# Altium schematic sheet 07-FPGA.SchDoc
size Tabloid; Customer: 01910
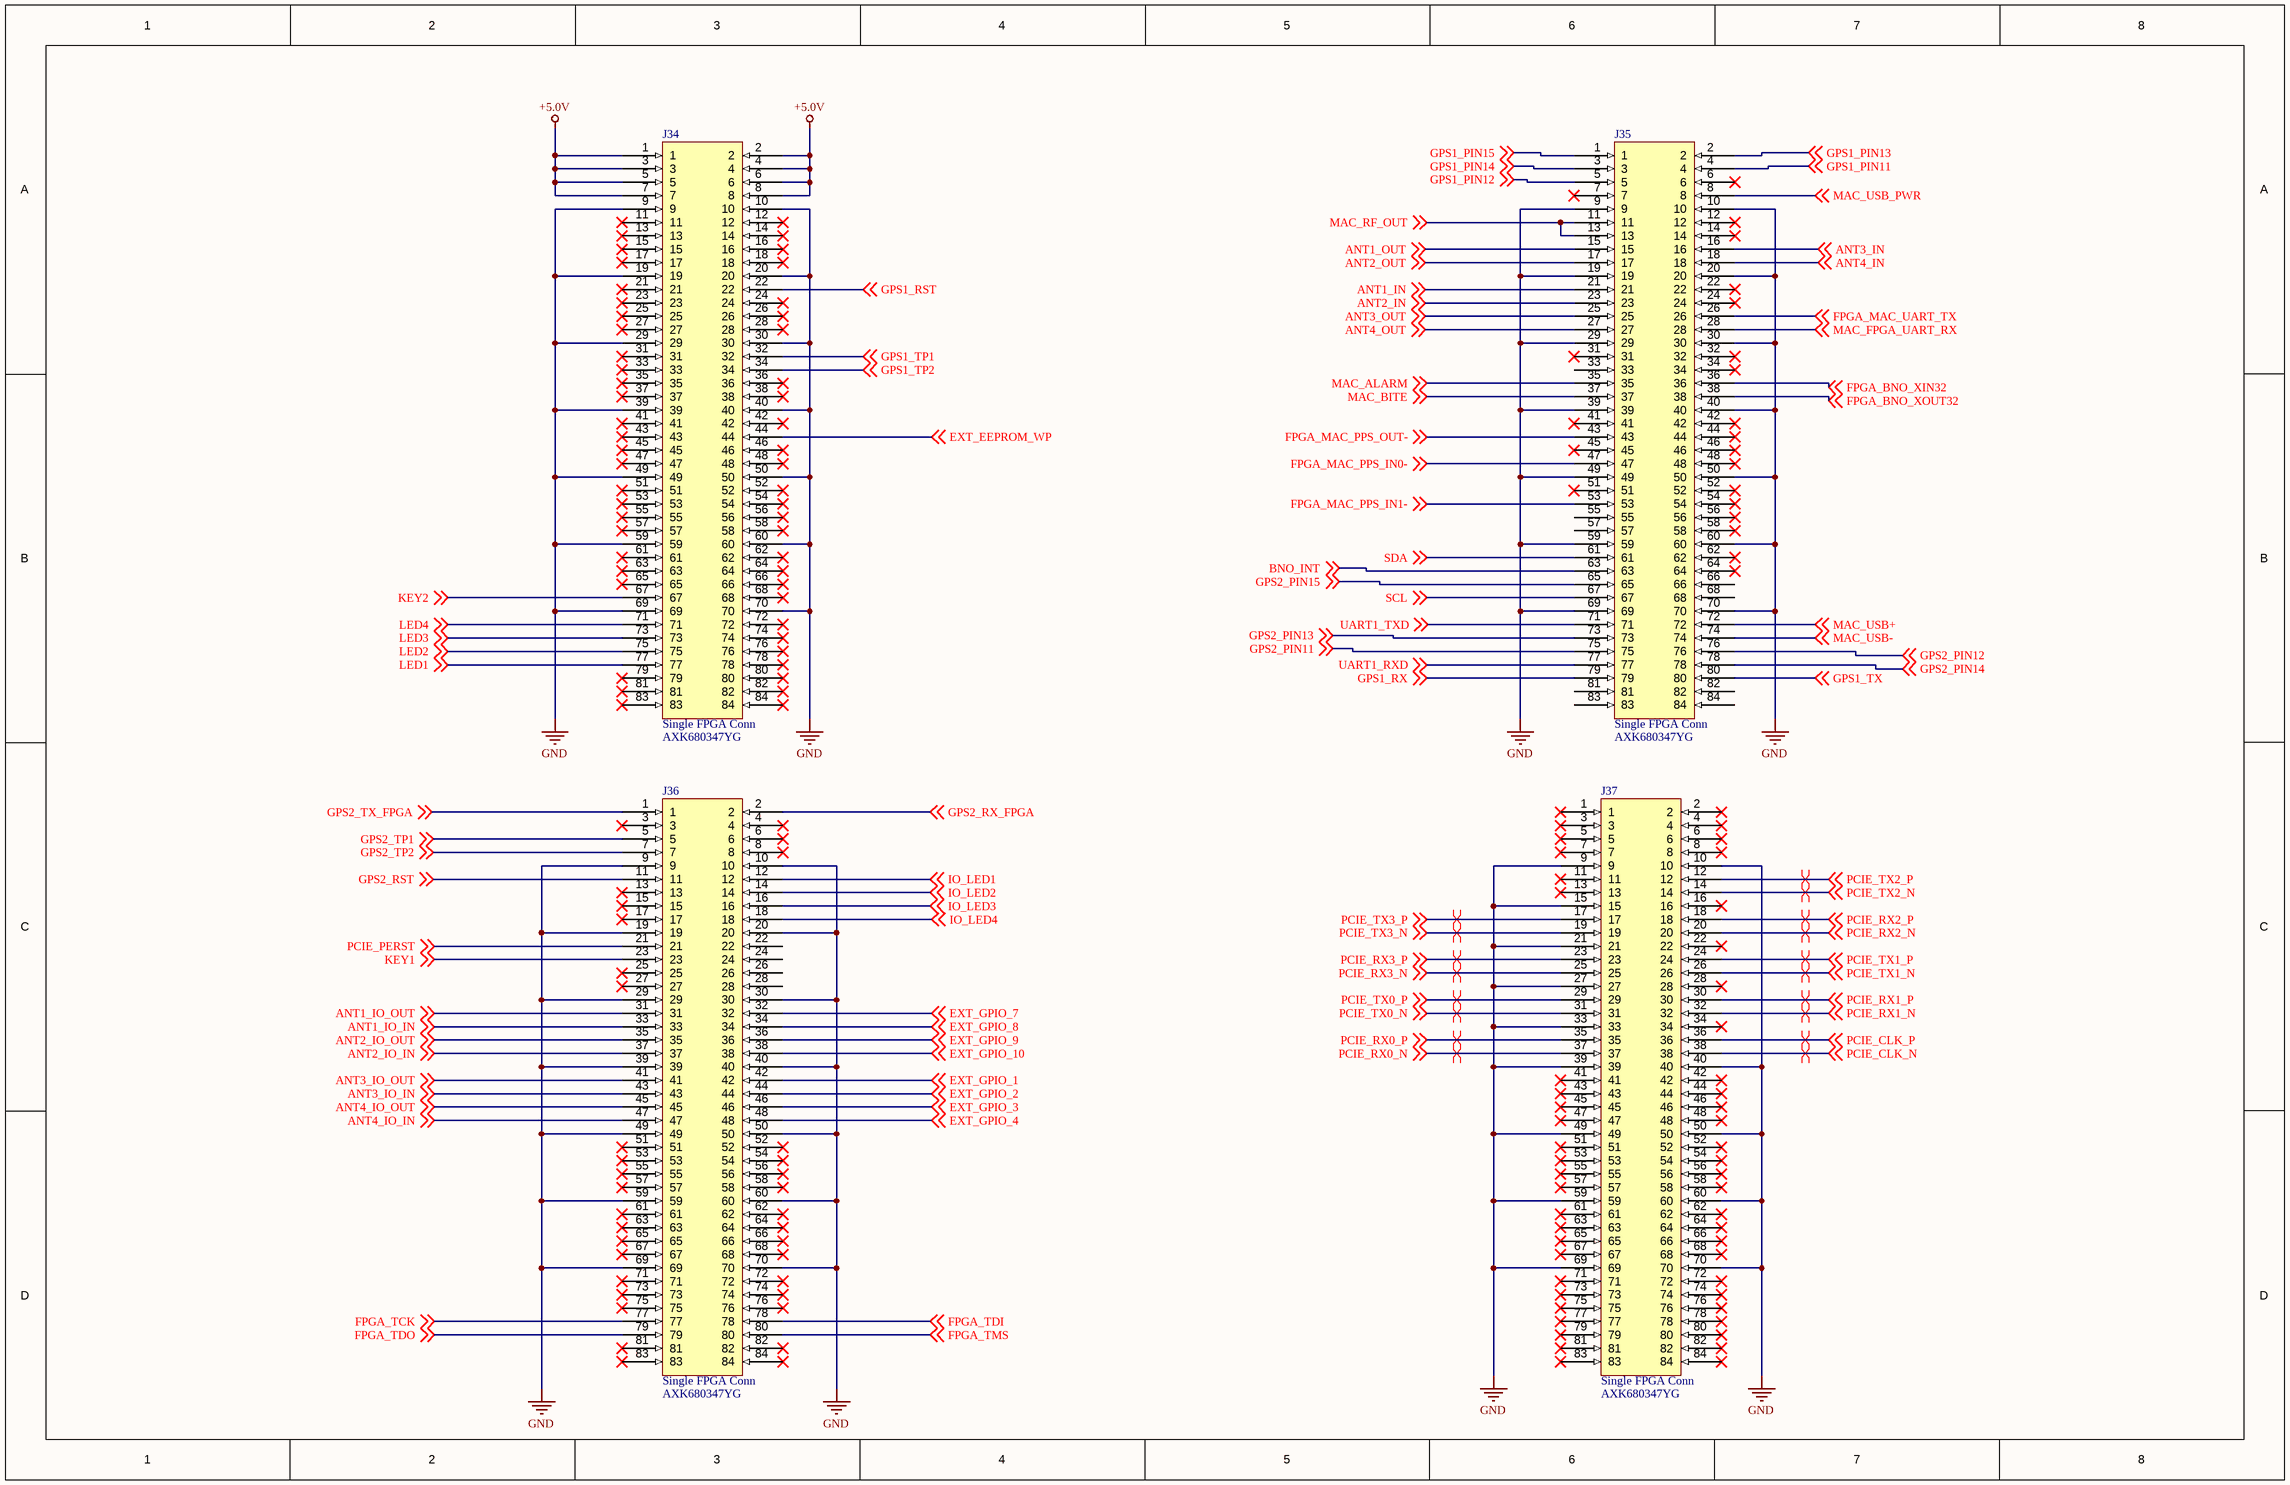
[diagram p0: 07-FPGA.SchDoc]

## Parts
J34  Single FPGA Conn  Part Number: AXK680347YG  [SingleFPGAConn]
J35  Single FPGA Conn  Part Number: AXK680347YG  [SingleFPGAConn]
J36  Single FPGA Conn  Part Number: AXK680347YG  [SingleFPGAConn]
J37  Single FPGA Conn  Part Number: AXK680347YG  [SingleFPGAConn]

## Nets
+5.0V: J34.1 J34.2 J34.3 J34.4 J34.5 J34.6 J34.7 J34.8
GND: J34.9 J34.10 J34.19 J34.20 J34.29 J34.30 J34.39 J34.40 J34.49 J34.50 J34.59 J34.60 J34.69 J34.70 J35.9 J35.10 J35.19 J35.20 J35.29 J35.30 J35.39 J35.40 J35.49 J35.50 J35.59 J35.60 J35.69 J35.70 J36.9 J36.10 J36.19 J36.20 J36.29 J36.30 J36.39 J36.40 J36.49 J36.50 J36.59 J36.60 J36.69 J36.70 J37.9 J37.10 J37.15 J37.21 J37.27 J37.33 J37.39 J37.40 J37.49 J37.50 J37.59 J37.60 J37.69 J37.70
ANT1_IN: J35.21 ; off-sheet ANT1_IN
ANT1_IO_IN: J36.33 ; off-sheet ANT1_IO_IN
ANT1_IO_OUT: J36.31 ; off-sheet ANT1_IO_OUT
ANT1_OUT: J35.15 ; off-sheet ANT1_OUT
ANT2_IN: J35.23 ; off-sheet ANT2_IN
ANT2_IO_IN: J36.37 ; off-sheet ANT2_IO_IN
ANT2_IO_OUT: J36.35 ; off-sheet ANT2_IO_OUT
ANT2_OUT: J35.17 ; off-sheet ANT2_OUT
ANT3_IN: J35.16 ; off-sheet ANT3_IN
ANT3_IO_IN: J36.43 ; off-sheet ANT3_IO_IN
ANT3_IO_OUT: J36.41 ; off-sheet ANT3_IO_OUT
ANT3_OUT: J35.25 ; off-sheet ANT3_OUT
ANT4_IN: J35.18 ; off-sheet ANT4_IN
ANT4_IO_IN: J36.47 ; off-sheet ANT4_IO_IN
ANT4_IO_OUT: J36.45 ; off-sheet ANT4_IO_OUT
ANT4_OUT: J35.27 ; off-sheet ANT4_OUT
BNO_INT: J35.63 ; off-sheet BNO_INT
EXT_EEPROM_WP: J34.44 ; off-sheet EXT_EEPROM_WP
EXT_GPIO_1: J36.42 ; off-sheet EXT_GPIO_1
EXT_GPIO_2: J36.44 ; off-sheet EXT_GPIO_2
EXT_GPIO_3: J36.46 ; off-sheet EXT_GPIO_3
EXT_GPIO_4: J36.48 ; off-sheet EXT_GPIO_4
EXT_GPIO_7: J36.32 ; off-sheet EXT_GPIO_7
EXT_GPIO_8: J36.34 ; off-sheet EXT_GPIO_8
EXT_GPIO_9: J36.36 ; off-sheet EXT_GPIO_9
EXT_GPIO_10: J36.38 ; off-sheet EXT_GPIO_10
FPGA_BNO_XIN32: J35.36 ; off-sheet FPGA_BNO_XIN32
FPGA_BNO_XOUT32: J35.38 ; off-sheet FPGA_BNO_XOUT32
FPGA_MAC_PPS_IN0-: J35.47 ; off-sheet FPGA_MAC_PPS_IN0-
FPGA_MAC_PPS_IN1-: J35.53 ; off-sheet FPGA_MAC_PPS_IN1-
FPGA_MAC_PPS_OUT-: J35.43 ; off-sheet FPGA_MAC_PPS_OUT-
FPGA_MAC_UART_TX: J35.26 ; off-sheet FPGA_MAC_UART_TX
FPGA_TCK: J36.77 ; off-sheet FPGA_TCK
FPGA_TDI: J36.78 ; off-sheet FPGA_TDI
FPGA_TDO: J36.79 ; off-sheet FPGA_TDO
FPGA_TMS: J36.80 ; off-sheet FPGA_TMS
GPS1_PIN11: J35.4 ; off-sheet GPS1_PIN11
GPS1_PIN12: J35.5 ; off-sheet GPS1_PIN12
GPS1_PIN13: J35.2 ; off-sheet GPS1_PIN13
GPS1_PIN14: J35.3 ; off-sheet GPS1_PIN14
GPS1_PIN15: J35.1 ; off-sheet GPS1_PIN15
GPS1_RST: J34.22 ; off-sheet GPS1_RST
GPS1_RX: J35.79 ; off-sheet GPS1_RX
GPS1_TP1: J34.32 ; off-sheet GPS1_TP1
GPS1_TP2: J34.34 ; off-sheet GPS1_TP2
GPS1_TX: J35.80 ; off-sheet GPS1_TX
GPS2_PIN11: J35.75 ; off-sheet GPS2_PIN11
GPS2_PIN12: J35.76 ; off-sheet GPS2_PIN12
GPS2_PIN13: J35.73 ; off-sheet GPS2_PIN13
GPS2_PIN14: J35.78 ; off-sheet GPS2_PIN14
GPS2_PIN15: J35.65 ; off-sheet GPS2_PIN15
GPS2_RST: J36.11 ; off-sheet GPS2_RST
GPS2_RX_FPGA: J36.2 ; off-sheet GPS2_RX_FPGA
GPS2_TP1: J36.5 ; off-sheet GPS2_TP1
GPS2_TP2: J36.7 ; off-sheet GPS2_TP2
GPS2_TX_FPGA: J36.1 ; off-sheet GPS2_TX_FPGA
IO_LED1: J36.12 ; off-sheet IO_LED1
IO_LED2: J36.14 ; off-sheet IO_LED2
IO_LED3: J36.16 ; off-sheet IO_LED3
IO_LED4: J36.18 ; off-sheet IO_LED4
KEY1: J36.23 ; off-sheet KEY1
KEY2: J34.67 ; off-sheet KEY2
LED1: J34.77 ; off-sheet LED1
LED2: J34.75 ; off-sheet LED2
LED3: J34.73 ; off-sheet LED3
LED4: J34.71 ; off-sheet LED4
MAC_ALARM: J35.35 ; off-sheet MAC_ALARM
MAC_BITE: J35.37 ; off-sheet MAC_BITE
MAC_FPGA_UART_RX: J35.28 ; off-sheet MAC_FPGA_UART_RX
MAC_RF_OUT: J35.11 J35.13 ; off-sheet MAC_RF_OUT
MAC_USB+: J35.72 ; off-sheet MAC_USB+
MAC_USB-: J35.74 ; off-sheet MAC_USB-
MAC_USB_PWR: J35.8 ; off-sheet MAC_USB_PWR
PCIE_CLK_N: J37.38 ; off-sheet PCIE_CLK_N
PCIE_CLK_P: J37.36 ; off-sheet PCIE_CLK_P
PCIE_PERST: J36.21 ; off-sheet PCIE_PERST
PCIE_RX0_N: J37.37 ; off-sheet PCIE_RX0_N
PCIE_RX0_P: J37.35 ; off-sheet PCIE_RX0_P
PCIE_RX1_N: J37.32 ; off-sheet PCIE_RX1_N
PCIE_RX1_P: J37.30 ; off-sheet PCIE_RX1_P
PCIE_RX2_N: J37.20 ; off-sheet PCIE_RX2_N
PCIE_RX2_P: J37.18 ; off-sheet PCIE_RX2_P
PCIE_RX3_N: J37.25 ; off-sheet PCIE_RX3_N
PCIE_RX3_P: J37.23 ; off-sheet PCIE_RX3_P
PCIE_TX0_N: J37.31 ; off-sheet PCIE_TX0_N
PCIE_TX0_P: J37.29 ; off-sheet PCIE_TX0_P
PCIE_TX1_N: J37.26 ; off-sheet PCIE_TX1_N
PCIE_TX1_P: J37.24 ; off-sheet PCIE_TX1_P
PCIE_TX2_N: J37.14 ; off-sheet PCIE_TX2_N
PCIE_TX2_P: J37.12 ; off-sheet PCIE_TX2_P
PCIE_TX3_N: J37.19 ; off-sheet PCIE_TX3_N
PCIE_TX3_P: J37.17 ; off-sheet PCIE_TX3_P
SCL: J35.67 ; off-sheet SCL
SDA: J35.61 ; off-sheet SDA
UART1_RXD: J35.77 ; off-sheet UART1_RXD
UART1_TXD: J35.71 ; off-sheet UART1_TXD

Not connected (* = marked no-connect by the designer): J34 11* 12* 13* 14* 15* 16* 17* 18* 21* 23* 24* 25* 26* 27* 28* 31* 33* 35* 36* 37* 38* 41* 42* 43* 45* 46* 47* 48* 51* 52* 53* 54* 55* 56* 57* 58* 61* 62* 63* 64* 65* 66* 68* 72* 74* 76* 78* 79* 80* 81* 82* 83* 84*; J35 6* 7* 12* 14* 22* 24* 31* 32* 33 34* 41* 42* 44* 45* 46* 48* 51* 52* 54* 55 56* 57 58* 62* 64* 66 68 81 82 83 84; J36 3* 4* 6* 8* 13* 15* 17* 22 24 25* 26 27* 28 51* 52* 53* 54* 55* 56* 57* 58* 61* 62* 63* 64* 65* 66* 67* 68* 71* 72* 73* 74* 75* 76* 81* 82* 83* 84*; J37 1* 2* 3* 4* 5* 6* 7* 8* 11* 13* 16* 22* 28* 34* 41* 42* 43* 44* 45* 46* 47* 48* 51* 52* 53* 54* 55* 56* 57* 58* 61* 62* 63* 64* 65* 66* 67* 68* 71* 72* 73* 74* 75* 76* 77* 78* 79* 80* 81* 82* 83* 84*

## Layout directives
differential pair: PCIE_CLK_N, PCIE_CLK_P, PCIE_RX0_N, PCIE_RX0_P, PCIE_RX1_N, PCIE_RX1_P, PCIE_RX2_N, PCIE_RX2_P, PCIE_RX3_N, PCIE_RX3_P, PCIE_TX0_N, PCIE_TX0_P, PCIE_TX1_N, PCIE_TX1_P, PCIE_TX2_N, PCIE_TX2_P, PCIE_TX3_N, PCIE_TX3_P

## Notes on the sheet
- SHEET
- REV
- timingcard.com <http://timingcard.com>
- DATE
- OF

## Library data of the parts
J34-J37 = Single FPGA Conn: Supplier 1: Digi-Key; Supplier Part Number 1: 255-3246-1-ND